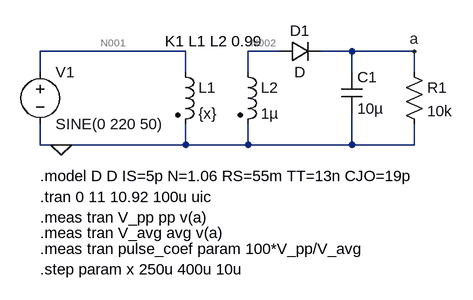
[diagram p0: schematic 1.2.2.asc]
1.2.2.asc, the LTspice schematic file:
Version 4
SHEET 1 880 680
WIRE 320 80 96 80
WIRE 464 80 416 80
WIRE 576 80 528 80
WIRE 672 80 576 80
WIRE 96 112 96 80
WIRE 320 112 320 80
WIRE 416 112 416 80
WIRE 576 112 576 80
WIRE 672 112 672 80
WIRE 96 224 96 192
WIRE 128 224 96 224
WIRE 320 224 320 192
WIRE 320 224 128 224
WIRE 416 224 416 192
WIRE 416 224 320 224
WIRE 576 224 576 176
WIRE 576 224 416 224
WIRE 672 224 672 192
WIRE 672 224 576 224
FLAG 128 224 0
FLAG 672 80 a
SYMBOL voltage 96 96 R0
WINDOW 123 0 0 Left 0
WINDOW 39 0 0 Left 0
SYMATTR InstName V1
SYMATTR Value SINE(0 220 50)
SYMBOL ind2 304 96 R0
SYMATTR InstName L1
SYMATTR Value {x}
SYMATTR SpiceLine Rser=10m
SYMATTR Type ind
SYMBOL ind2 400 96 R0
SYMATTR InstName L2
SYMATTR Value 1µ
SYMATTR SpiceLine Rser=10m
SYMATTR Type ind
SYMBOL diode 464 96 R270
WINDOW 0 32 32 VTop 2
WINDOW 3 0 32 VBottom 2
SYMATTR InstName D1
SYMBOL cap 560 112 R0
SYMATTR InstName C1
SYMATTR Value 10µ
SYMBOL res 656 96 R0
SYMATTR InstName R1
SYMATTR Value 10k
TEXT 96 272 Left 2 !.model D D IS=5p N=1.06 RS=55m TT=13n CJO=19p
TEXT 96 304 Left 2 !.tran 0 11 10.92 100u uic
TEXT 96 336 Left 2 !.meas tran V_pp pp v(a)
TEXT 96 360 Left 2 !.meas tran V_avg avg v(a)
TEXT 96 384 Left 2 !.meas tran pulse_coef param 100*V_pp/V_avg
TEXT 288 64 Left 2 !K1 L1 L2 0.99
TEXT 96 416 Left 2 !.step param x 250u 400u 10u

The netlist it stands for:
* 1.2.2.asc
V1 N001 0 SINE(0 220 50)
L1 N001 0 {x} Rser=10m
L2 N002 0 1µ Rser=10m
D1 N002 a D
C1 a 0 10µ
R1 a 0 10k
.model D D
.lib standard.dio
.model D D IS=5p N=1.06 RS=55m TT=13n CJO=19p
.tran 0 11 10.92 100u uic
.meas tran V_pp pp v(a)
.meas tran V_avg avg v(a)
.meas tran pulse_coef param 100*V_pp/V_avg
K1 L1 L2 0.99
.step param x 250u 400u 10u
.backanno
.end

* Results of the author's LTspice run, read from the files saved beside the schematic
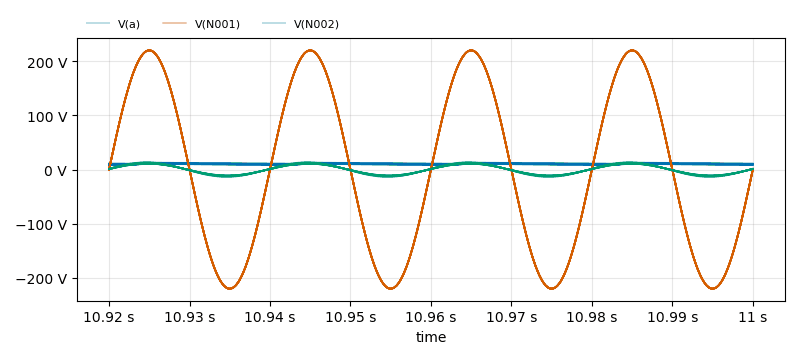
[diagram p1: Transient Analysis of 1.2.2.asc, plotted from the saved traces]
* Transient Analysis, 16 runs:
*   V(a) [x=0.00025]: min 10.97 V, max 13.12 V, average 12.06 V, rms 12.07 V, last 11.28 V
*   V(a) [x=0.00026]: min 10.76 V, max 12.86 V, average 11.82 V, rms 11.84 V, last 11.06 V
*   V(a) [x=0.00027]: min 10.55 V, max 12.62 V, average 11.6 V, rms 11.61 V, last 10.85 V
*   V(a) [x=0.00028]: min 10.36 V, max 12.39 V, average 11.38 V, rms 11.4 V, last 10.65 V
*   V(a) [x=0.00029]: min 10.18 V, max 12.17 V, average 11.18 V, rms 11.2 V, last 10.47 V
*   V(a) [x=0.0003]: min 10 V, max 11.96 V, average 10.99 V, rms 11.01 V, last 10.29 V
*   V(a) [x=0.00031]: min 9.836 V, max 11.76 V, average 10.81 V, rms 10.82 V, last 10.12 V
*   V(a) [x=0.00032]: min 9.678 V, max 11.57 V, average 10.64 V, rms 10.65 V, last 9.958 V
*   V(N001) [x=0.00025]: min -219.8 V, max 220 V, average 21.78 mV, rms 155.6 V, last 0 V
*   V(N001) [x=0.00026]: min -219.8 V, max 220 V, average 22.76 mV, rms 155.6 V, last 0 V
*   V(N001) [x=0.00027]: min -219.9 V, max 220 V, average 22.93 mV, rms 155.6 V, last 0 V
*   V(N001) [x=0.00028]: min -219.9 V, max 220 V, average 22.94 mV, rms 155.6 V, last 0 V
*   V(N001) [x=0.00029]: min -219.9 V, max 220 V, average 25.18 mV, rms 155.6 V, last 0 V
*   V(N001) [x=0.0003]: min -220 V, max 220 V, average 23.89 mV, rms 155.6 V, last 0 V
*   V(N001) [x=0.00031]: min -220 V, max 220 V, average 23.47 mV, rms 155.6 V, last 0 V
*   V(N001) [x=0.00032]: min -220 V, max 220 V, average 24.84 mV, rms 155.6 V, last 0 V
*   V(N002) [x=0.00025]: min -13.66 V, max 13.66 V, average 1.434 mV, rms 9.661 V, last 1.726 V
*   V(N002) [x=0.00026]: min -13.4 V, max 13.4 V, average 1.47 mV, rms 9.48 V, last 1.629 V
*   V(N002) [x=0.00027]: min -13.16 V, max 13.16 V, average 1.441 mV, rms 9.307 V, last 1.541 V
*   V(N002) [x=0.00028]: min -12.93 V, max 12.93 V, average 1.402 mV, rms 9.144 V, last 1.461 V
*   V(N002) [x=0.00029]: min -12.71 V, max 12.71 V, average 1.518 mV, rms 8.989 V, last 1.387 V
*   V(N002) [x=0.0003]: min -12.5 V, max 12.5 V, average 1.423 mV, rms 8.841 V, last 1.319 V
*   V(N002) [x=0.00031]: min -12.3 V, max 12.3 V, average 1.376 mV, rms 8.7 V, last 1.257 V
*   V(N002) [x=0.00032]: min -12.11 V, max 12.11 V, average 1.426 mV, rms 8.566 V, last 1.199 V
* From the log:
*   Measurement: v_pp
*     step  PP(v(a))  FROM  TO
*        1  2.15114  0  0.08
*        2  2.10888  0  0.08
*        3  2.06866  0  0.08
*        4  2.031  0  0.08
*        5  1.99486  0  0.08
*        6  1.96046  0  0.08
*        7  1.92756  0  0.08
*        8  1.89655  0  0.08
*        9  1.86645  0  0.08
*       10  1.83741  0  0.08
*       11  1.81054  0  0.08
*       12  1.7845  0  0.08
*       13  1.75916  0  0.08
*       14  1.73451  0  0.08
*       15  1.71157  0  0.08
*       16  1.68916  0  0.08
*   Measurement: v_avg
*     step  AVG(v(a))  FROM  TO
*        1  12.0553  0  0.08
*        2  11.8195  0  0.08
*        3  11.5963  0  0.08
*        4  11.3845  0  0.08
*        5  11.1834  0  0.08
*        6  10.992  0  0.08
*        7  10.8096  0  0.08
*        8  10.6356  0  0.08
*        9  10.4693  0  0.08
*       10  10.3101  0  0.08
*       11  10.1576  0  0.08
*       12  10.0114  0  0.08
*       13  9.87095  0  0.08
*       14  9.73593  0  0.08
*       15  9.60616  0  0.08
*       16  9.48099  0  0.08
*   Measurement: pulse_coef
*     step  100*v_pp/v_avg
*        1  17.844
*        2  17.8425
*        3  17.839
*        4  17.84
*        5  17.8376
*        6  17.8353
*        7  17.8319
*        8  17.8321
*        9  17.8279
*       10  17.8215
*       11  17.8244
*       12  17.8247
*       13  17.8216
*       14  17.8156
*       15  17.8175
*       16  17.8163